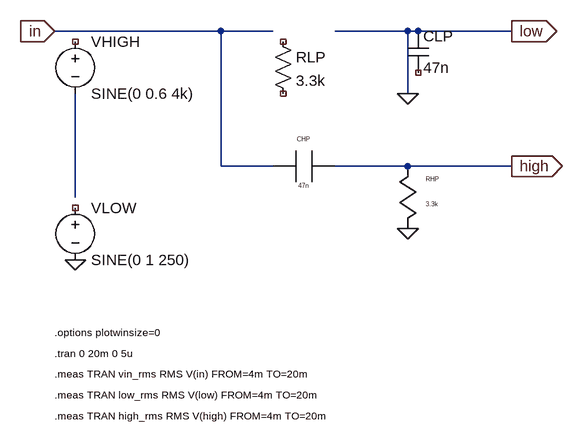
[diagram p0: schematic passive_rc_spectrum_split.asc]
passive_rc_spectrum_split.asc, the LTspice schematic file:
Version 4
SHEET 1 1200 983
WIRE 64 176 400 176
WIRE 320 176 320 384
WIRE 320 384 400 384
WIRE 496 176 768 176
WIRE 608 176 608 272
WIRE 496 384 768 384
WIRE 96 272 96 432
SYMBOL voltage 96 176 R0
SYMATTR InstName VHIGH
SYMATTR Value SINE(0 0.6 4k)
SYMBOL voltage 96 432 R0
SYMATTR InstName VLOW
SYMATTR Value SINE(0 1 250)
SYMBOL res 400 176 R0
SYMATTR InstName RLP
SYMATTR Value 3.3k
SYMBOL cap 608 176 R0
SYMATTR InstName CLP
SYMATTR Value 47n
SYMBOL cap_h 400 384 R0
SYMATTR InstName CHP
SYMATTR Value 47n
SYMBOL res_v 608 384 R0
SYMATTR InstName RHP
SYMATTR Value 3.3k
FLAG 64 176 in
IOPIN 64 176 In
FLAG 768 176 low
IOPIN 768 176 Out
FLAG 768 384 high
IOPIN 768 384 Out
FLAG 96 528 0
FLAG 608 272 0
FLAG 608 480 0
TEXT 64 640 Left 1 !.options plotwinsize=0
TEXT 64 672 Left 1 !.tran 0 20m 0 5u
TEXT 64 704 Left 1 !.meas TRAN vin_rms RMS V(in) FROM=4m TO=20m
TEXT 64 736 Left 1 !.meas TRAN low_rms RMS V(low) FROM=4m TO=20m
TEXT 64 768 Left 1 !.meas TRAN high_rms RMS V(high) FROM=4m TO=20m

The netlist it stands for:
* passive_rc_spectrum_split.asc
VHIGH NC_01 N001 SINE(0 0.6 4k)
VLOW NC_02 0 SINE(0 1 250)
RLP NC_03 NC_04 3.3k
CLP 0 NC_05 47n
CHP in high 47n
RHP high 0 3.3k
.options plotwinsize=0
.tran 0 20m 0 5u
.meas TRAN vin_rms RMS V(in) FROM=4m TO=20m
.meas TRAN low_rms RMS V(low) FROM=4m TO=20m
.meas TRAN high_rms RMS V(high) FROM=4m TO=20m
.backanno
.end